# Altium schematic sheet Sheet1.SchDoc
size A4; SheetNumber: 1; SheetTotal: 1
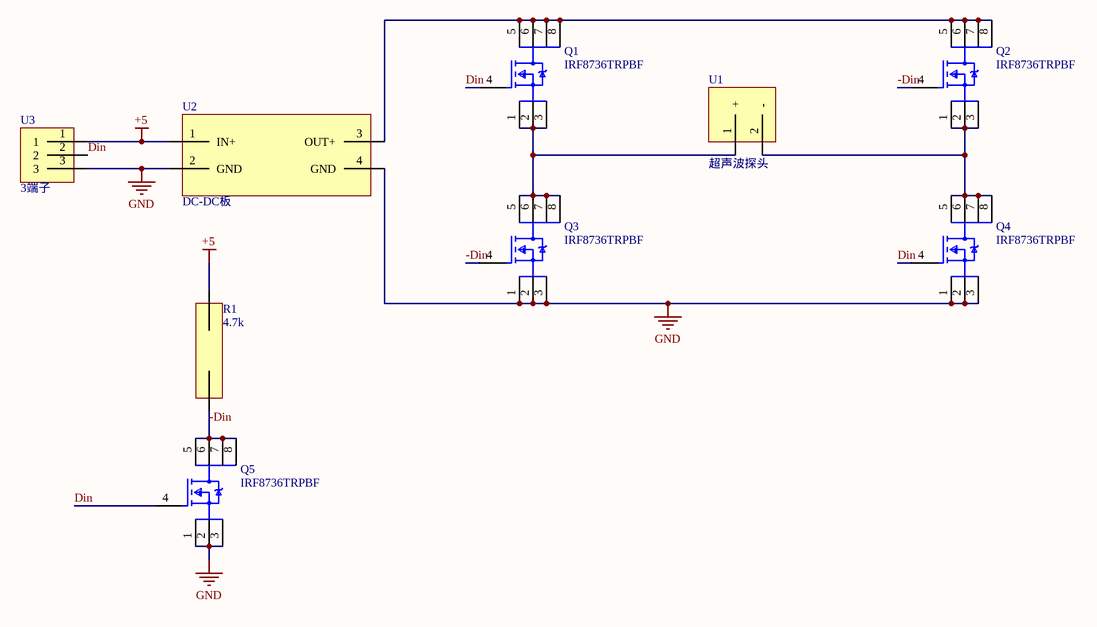
[diagram p0: Sheet1.SchDoc]

## Parts
Q1  IRF8736TRPBF  [FP-PG-DSO-8-MFG]
Q2  IRF8736TRPBF  [FP-PG-DSO-8-MFG]
Q3  IRF8736TRPBF  [FP-PG-DSO-8-MFG]
Q4  IRF8736TRPBF  [FP-PG-DSO-8-MFG]
Q5  IRF8736TRPBF  [FP-PG-DSO-8-MFG]
R1  4.7k  [0603]
U1  超声波探头  [超声波探头]
U2  DC-DC板  [DC-DC板]
U3  3端子  [HDR2.54-LI-3P]

## Nets
+5: R1.2 U2.1(IN+) U3.1
GND: Q3.1(S) Q3.2(S) Q3.3(S) Q4.1(S) Q4.2(S) Q4.3(S) Q5.1(S) Q5.2(S) Q5.3(S) U2.2(GND) U2.4(GND) U3.3
-Din: Q2.4(G) Q3.4(G) Q5.5(D) Q5.6(D) Q5.7(D) Q5.8(D) R1.1
Din: Q1.4(G) Q4.4(G) Q5.4(G) U3.2
NetQ1_1: Q1.1(S) Q1.2(S) Q1.3(S) Q3.5(D) Q3.6(D) Q3.7(D) Q3.8(D) U1.1(+)
NetQ1_5: Q1.5(D) Q1.6(D) Q1.7(D) Q1.8(D) Q2.5(D) Q2.6(D) Q2.7(D) Q2.8(D) U2.3(OUT+)
NetQ2_1: Q2.1(S) Q2.2(S) Q2.3(S) Q4.5(D) Q4.6(D) Q4.7(D) Q4.8(D) U1.2(-)

## Library data of the parts
Q1-Q5 = CMP-32901-000123-1: MOSFET N-CH 30V 18A 8-SOIC; Manufacturer: Infineon; Depletion Mode: False; Max Junction Temp: +150°C; Reverse Recovery Charge: 19nC; Power Dissipation: 2.5W; Threshold Vgs Max: 2.35V; Number Of Channels: 1; Standoff Height: 0.1mm; Reverse Recovery Time: 16ns; Turn On Delay Time: 12ns; Gate To Source Voltage: 20V; Turn Off Delay Time: 13ns; Input Capacitace At Vds: 2315pF @ 15V; Gate Charge At Vgs: 17nC @ 4.5V; Rthja Max: 50°C/W; Max Forward Diode Voltage: 1V; Drain To Source Resistance: 5.5mΩ; Pulse Drain Current: 144A; Threshold Vgs Min: 1.35V; Digikey Description: MOSFET N-CH 30V 18A 8-SOIC; Temperature Range Low: -55°C; Ipc Land Pattern Name: SOIC127P600X155-8; Octopart: https://octopart.com/irf8736trpbf-infineon-65873731; Device Class L2: Transistors; Drain To Source Voltage: 30V; Drain To Source Breakdown Voltage: 30V; Device Class L3: MOSFETs; Category: Trans; Footprint Url: https://www.infineon.com/dgdl/po-so8.pdf?fileId=5546d462580663ef0158068a1275014d; Package: PG-DSO-8; Device Class L1: Discrete Semiconductors; Automotive: No; Manufacturer Part Number: IRF8736TRPBF; Temperature: -55°C to +150°C; Height: 1.75mm; RoHS: TRUE; ComponentLink2URL: https://www.infineon.com/dgdl/irf8736pbf.pdf?fileId=5546d462533600a40153560d9e661d7f; Number Of N Channels: 1; ComponentLink2Description: Datasheet; Continuous Drain Current: 18A; Lead Free: Yes; Temperature Range High: +150°C
R1 = 0603